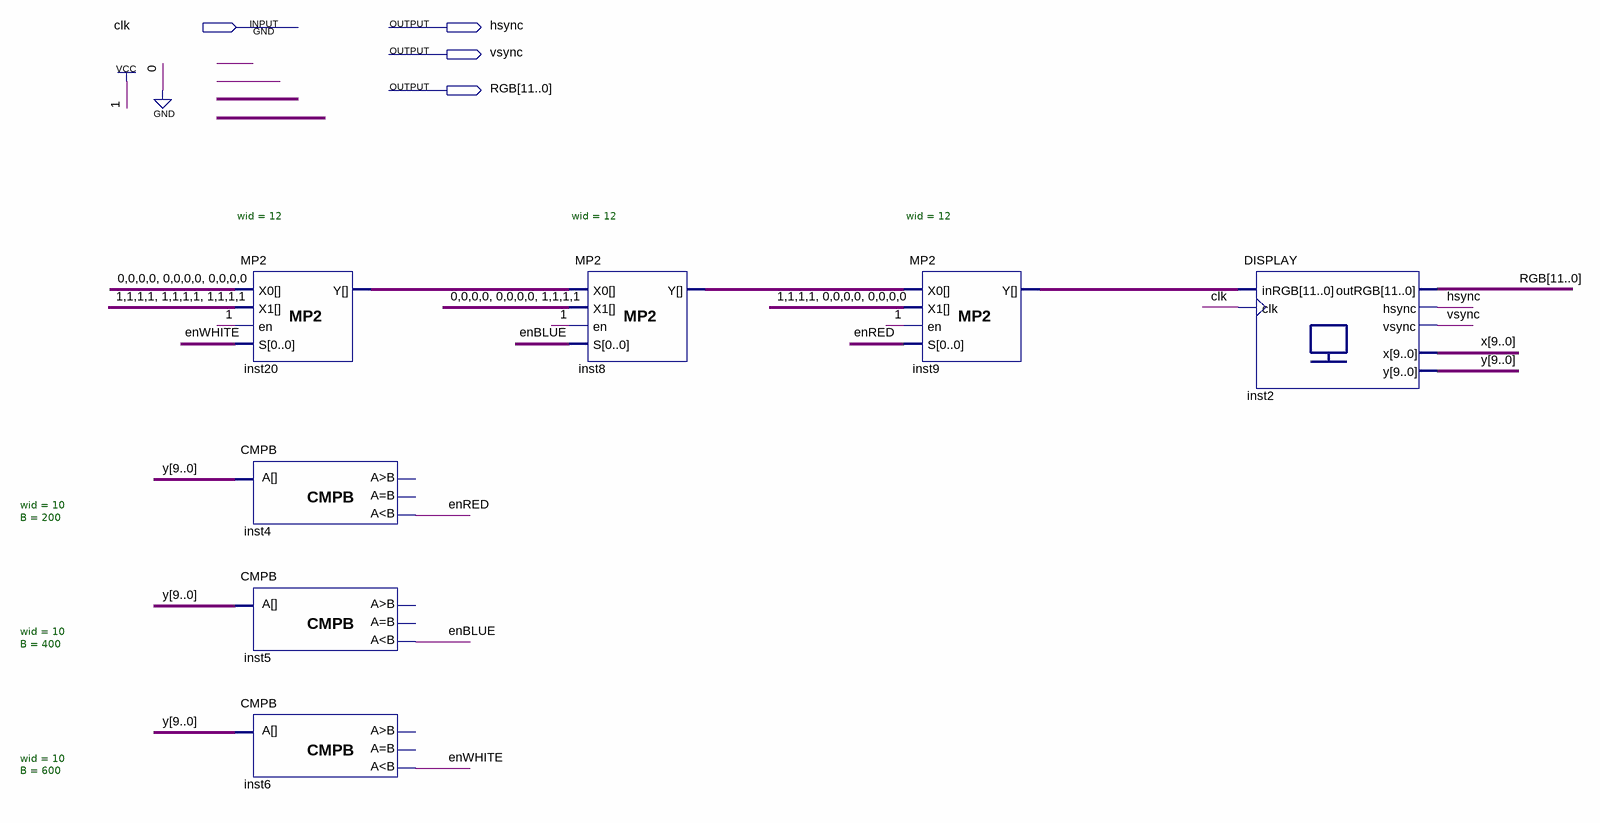
[diagram p0: schematic sheet]
// Quartus schematic main_2.bdf as structural Verilog: 7 symbols, 4 pins
module main_2 (
  input  clk,
  output hsync,
  output vsync,
  output [11:0] RGB
);

  wire enBLUE, enRED, enWHITE;
  wire [9:0] x, y;
  wire [11:0] inst8_y, inst9_y, inst20_y;

  MP2 #(.wid(12)) inst20 (.X0({12{1'b0}}), .X1({12{1'b1}}), .en(1'b1), .S(enWHITE), .Y(inst20_y));
  CMPB #(.wid(10), .B(200)) inst4 (.A(y), .ls(enRED));  // open: gr, eq
  CMPB #(.wid(10), .B(400)) inst5 (.A(y), .ls(enBLUE));  // open: gr, eq
  CMPB #(.wid(10), .B(600)) inst6 (.A(y), .ls(enWHITE));  // open: gr, eq
  MP2 #(.wid(12)) inst8 (.X0(inst20_y), .X1(12'b000000001111), .en(1'b1), .S(enBLUE), .Y(inst8_y));
  MP2 #(.wid(12)) inst9 (.X0(inst8_y), .X1(12'b111100000000), .en(1'b1), .S(enRED), .Y(inst9_y));
  DISPLAY inst2 (.inRGB(inst9_y), .clk(clk), .outRGB(RGB), .hsync(hsync), .vsync(vsync), .x(x), .y(y));
endmodule
